# EAGLE schematic ESP32 Display 2.4 inch V1.0 (EAGLE 9.6.2)
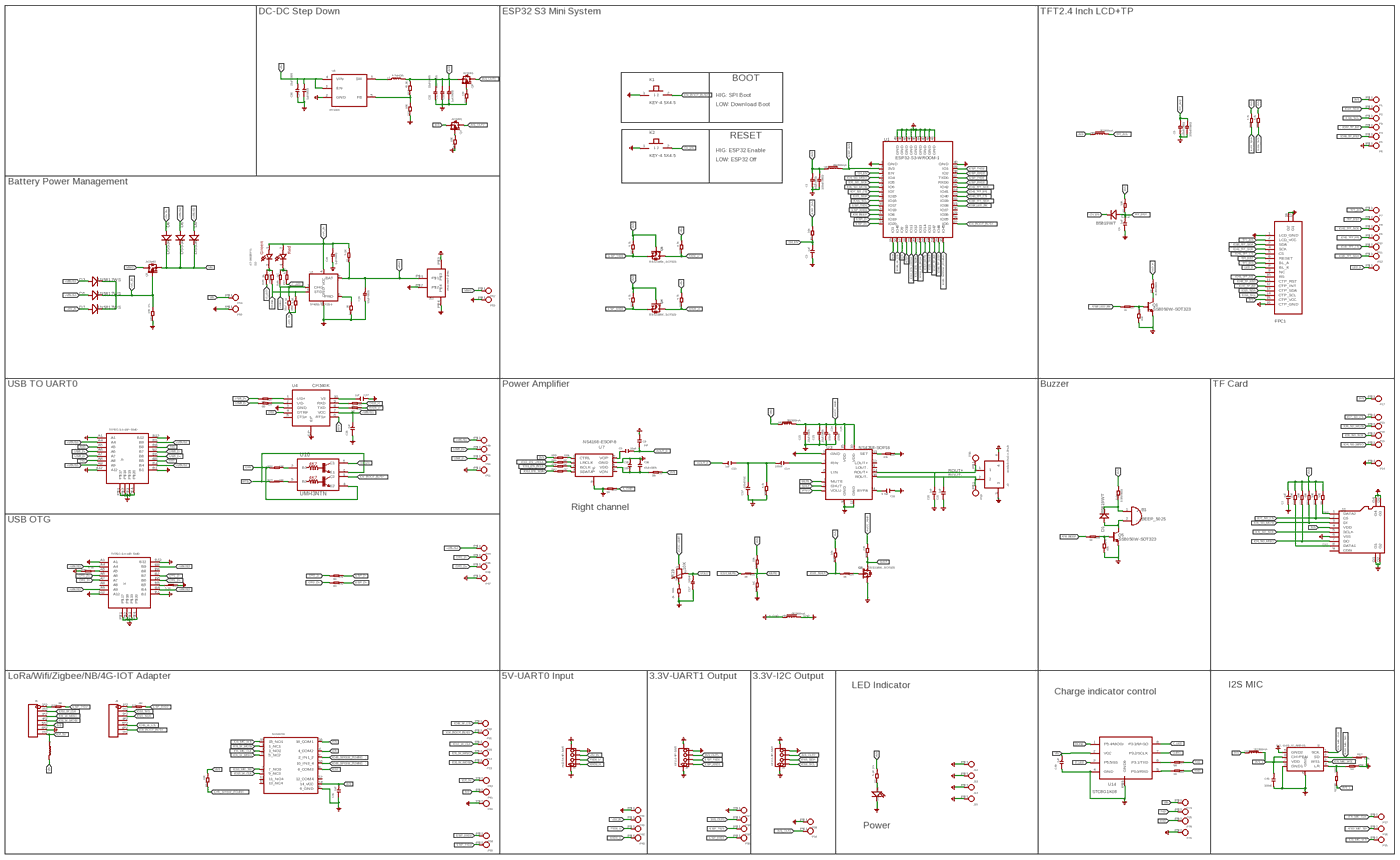
[diagram p0: schematic, sheet 1, overview]
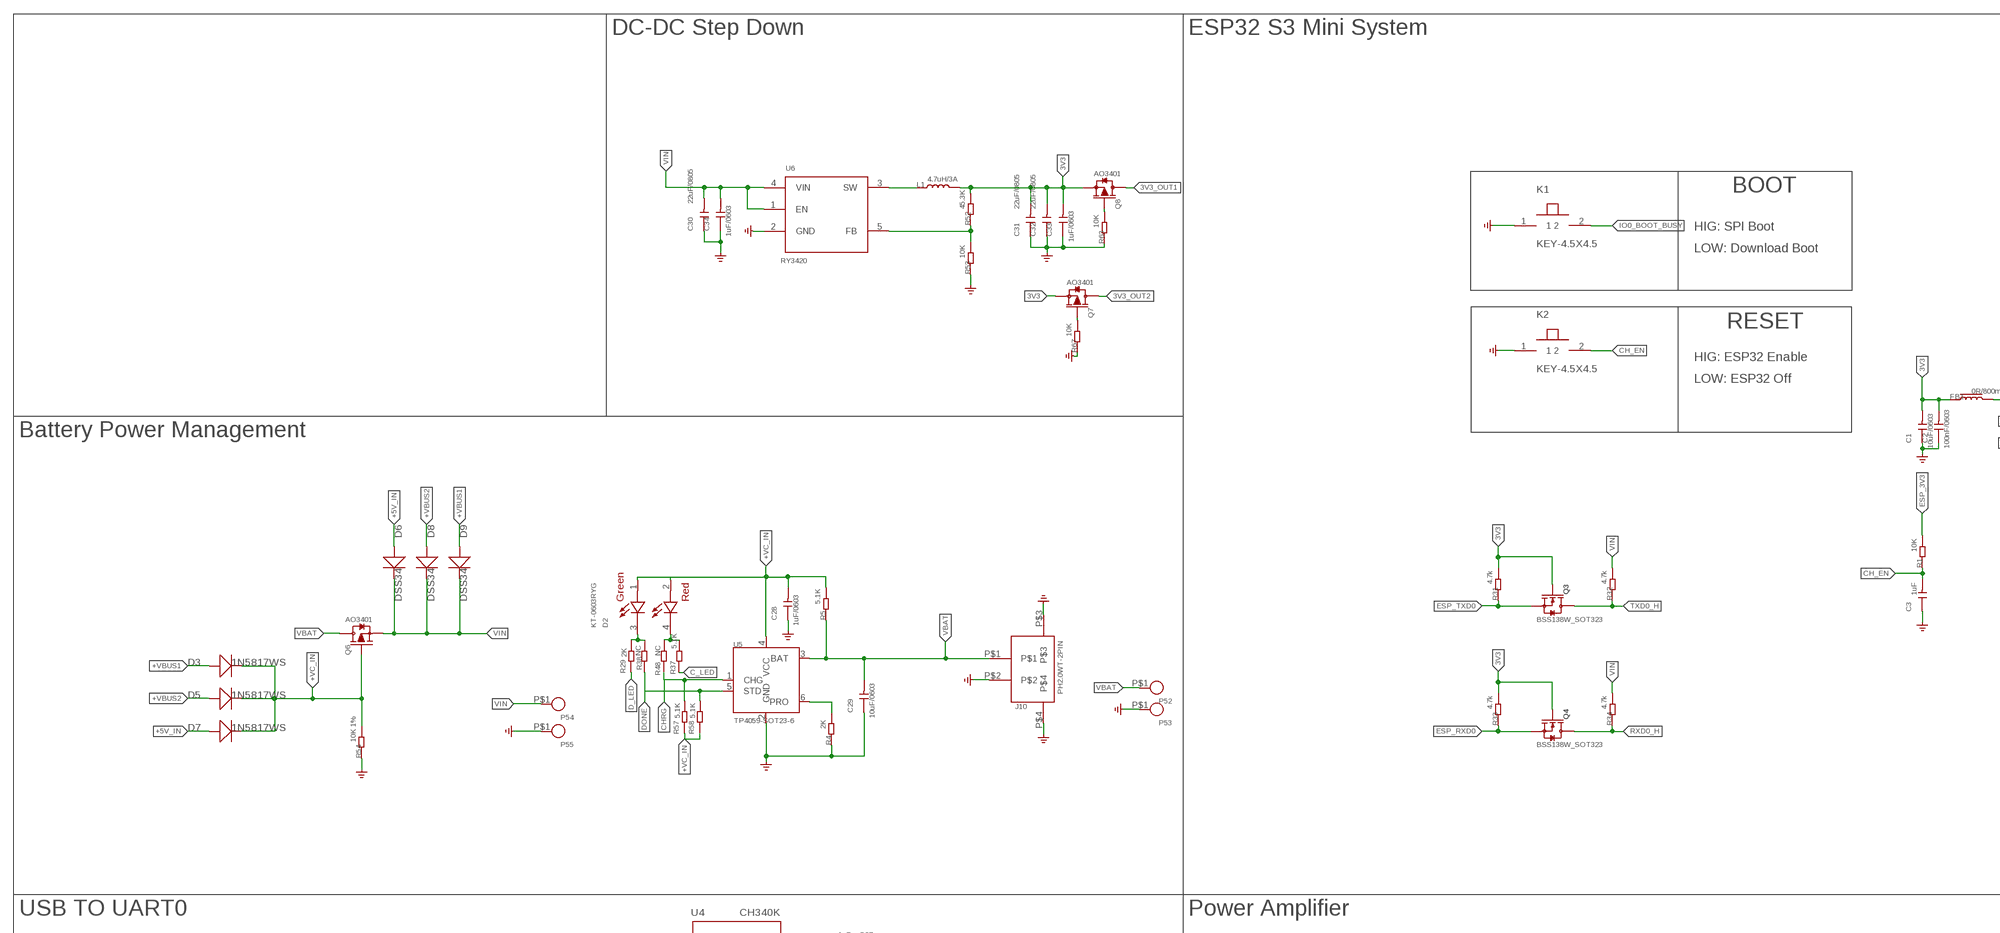
[diagram p1: schematic, sheet 1, part 1 of 4]
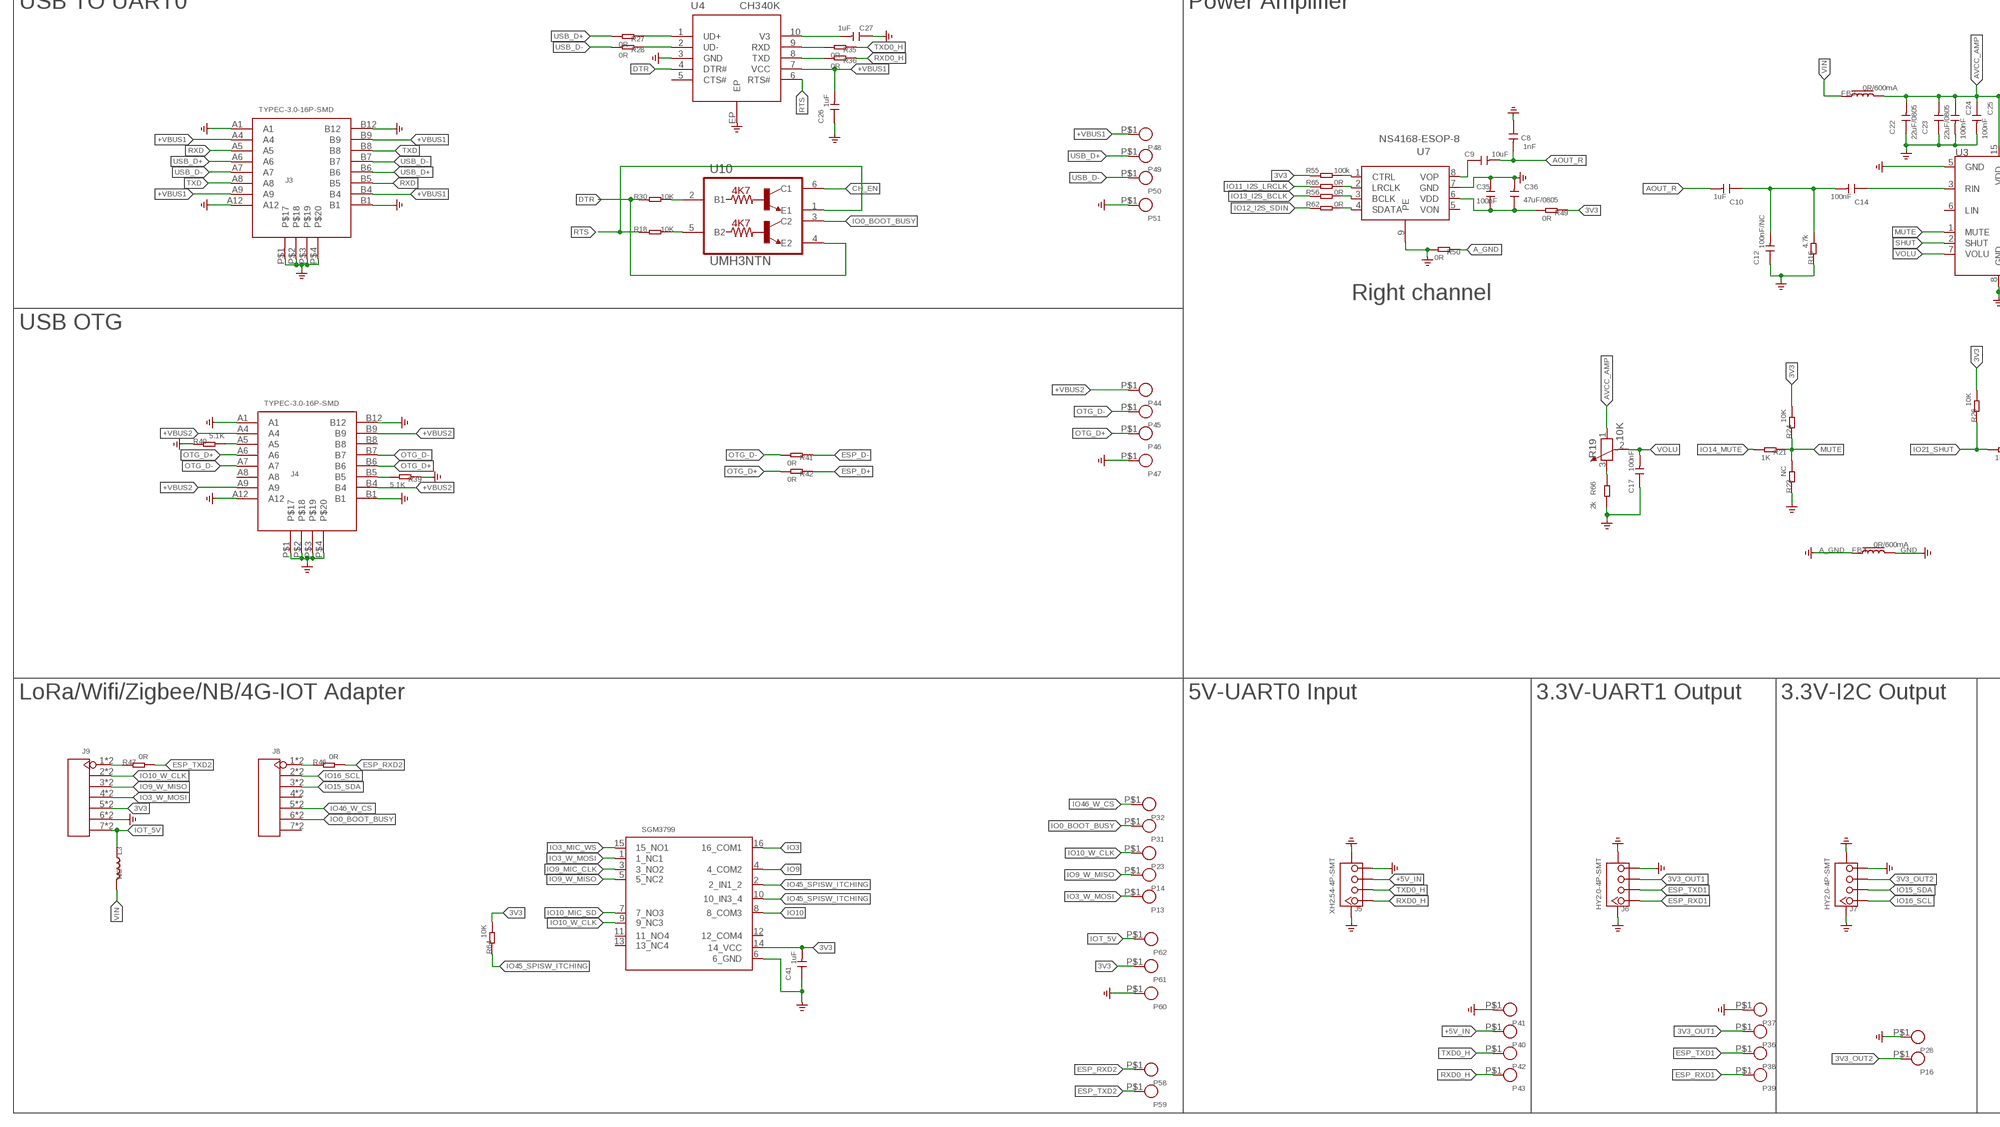
[diagram p2: schematic, sheet 1, part 2 of 4]
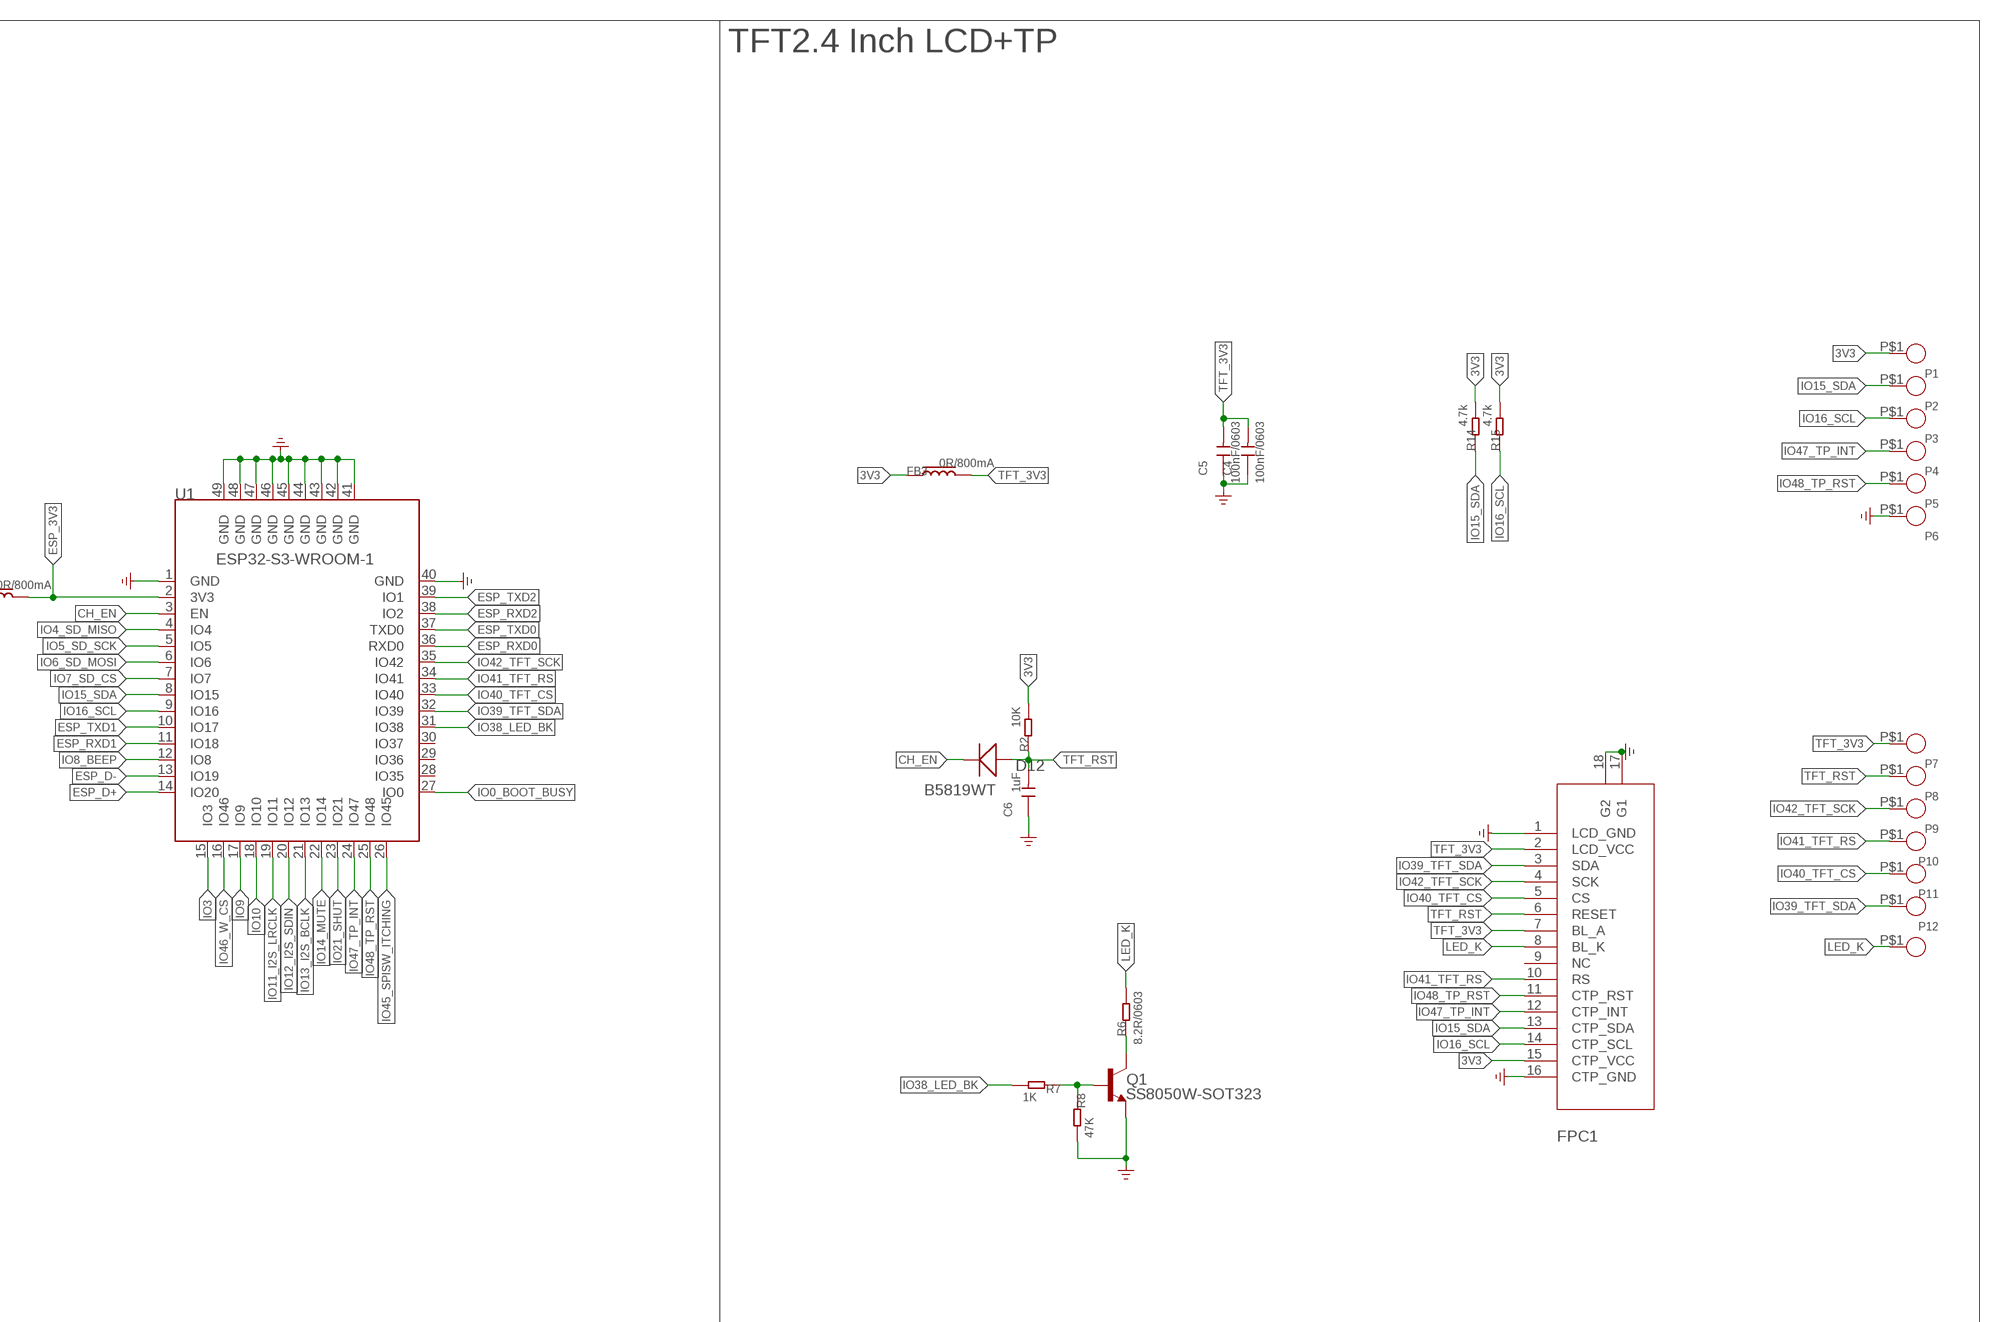
[diagram p3: schematic, sheet 1, part 3 of 4]
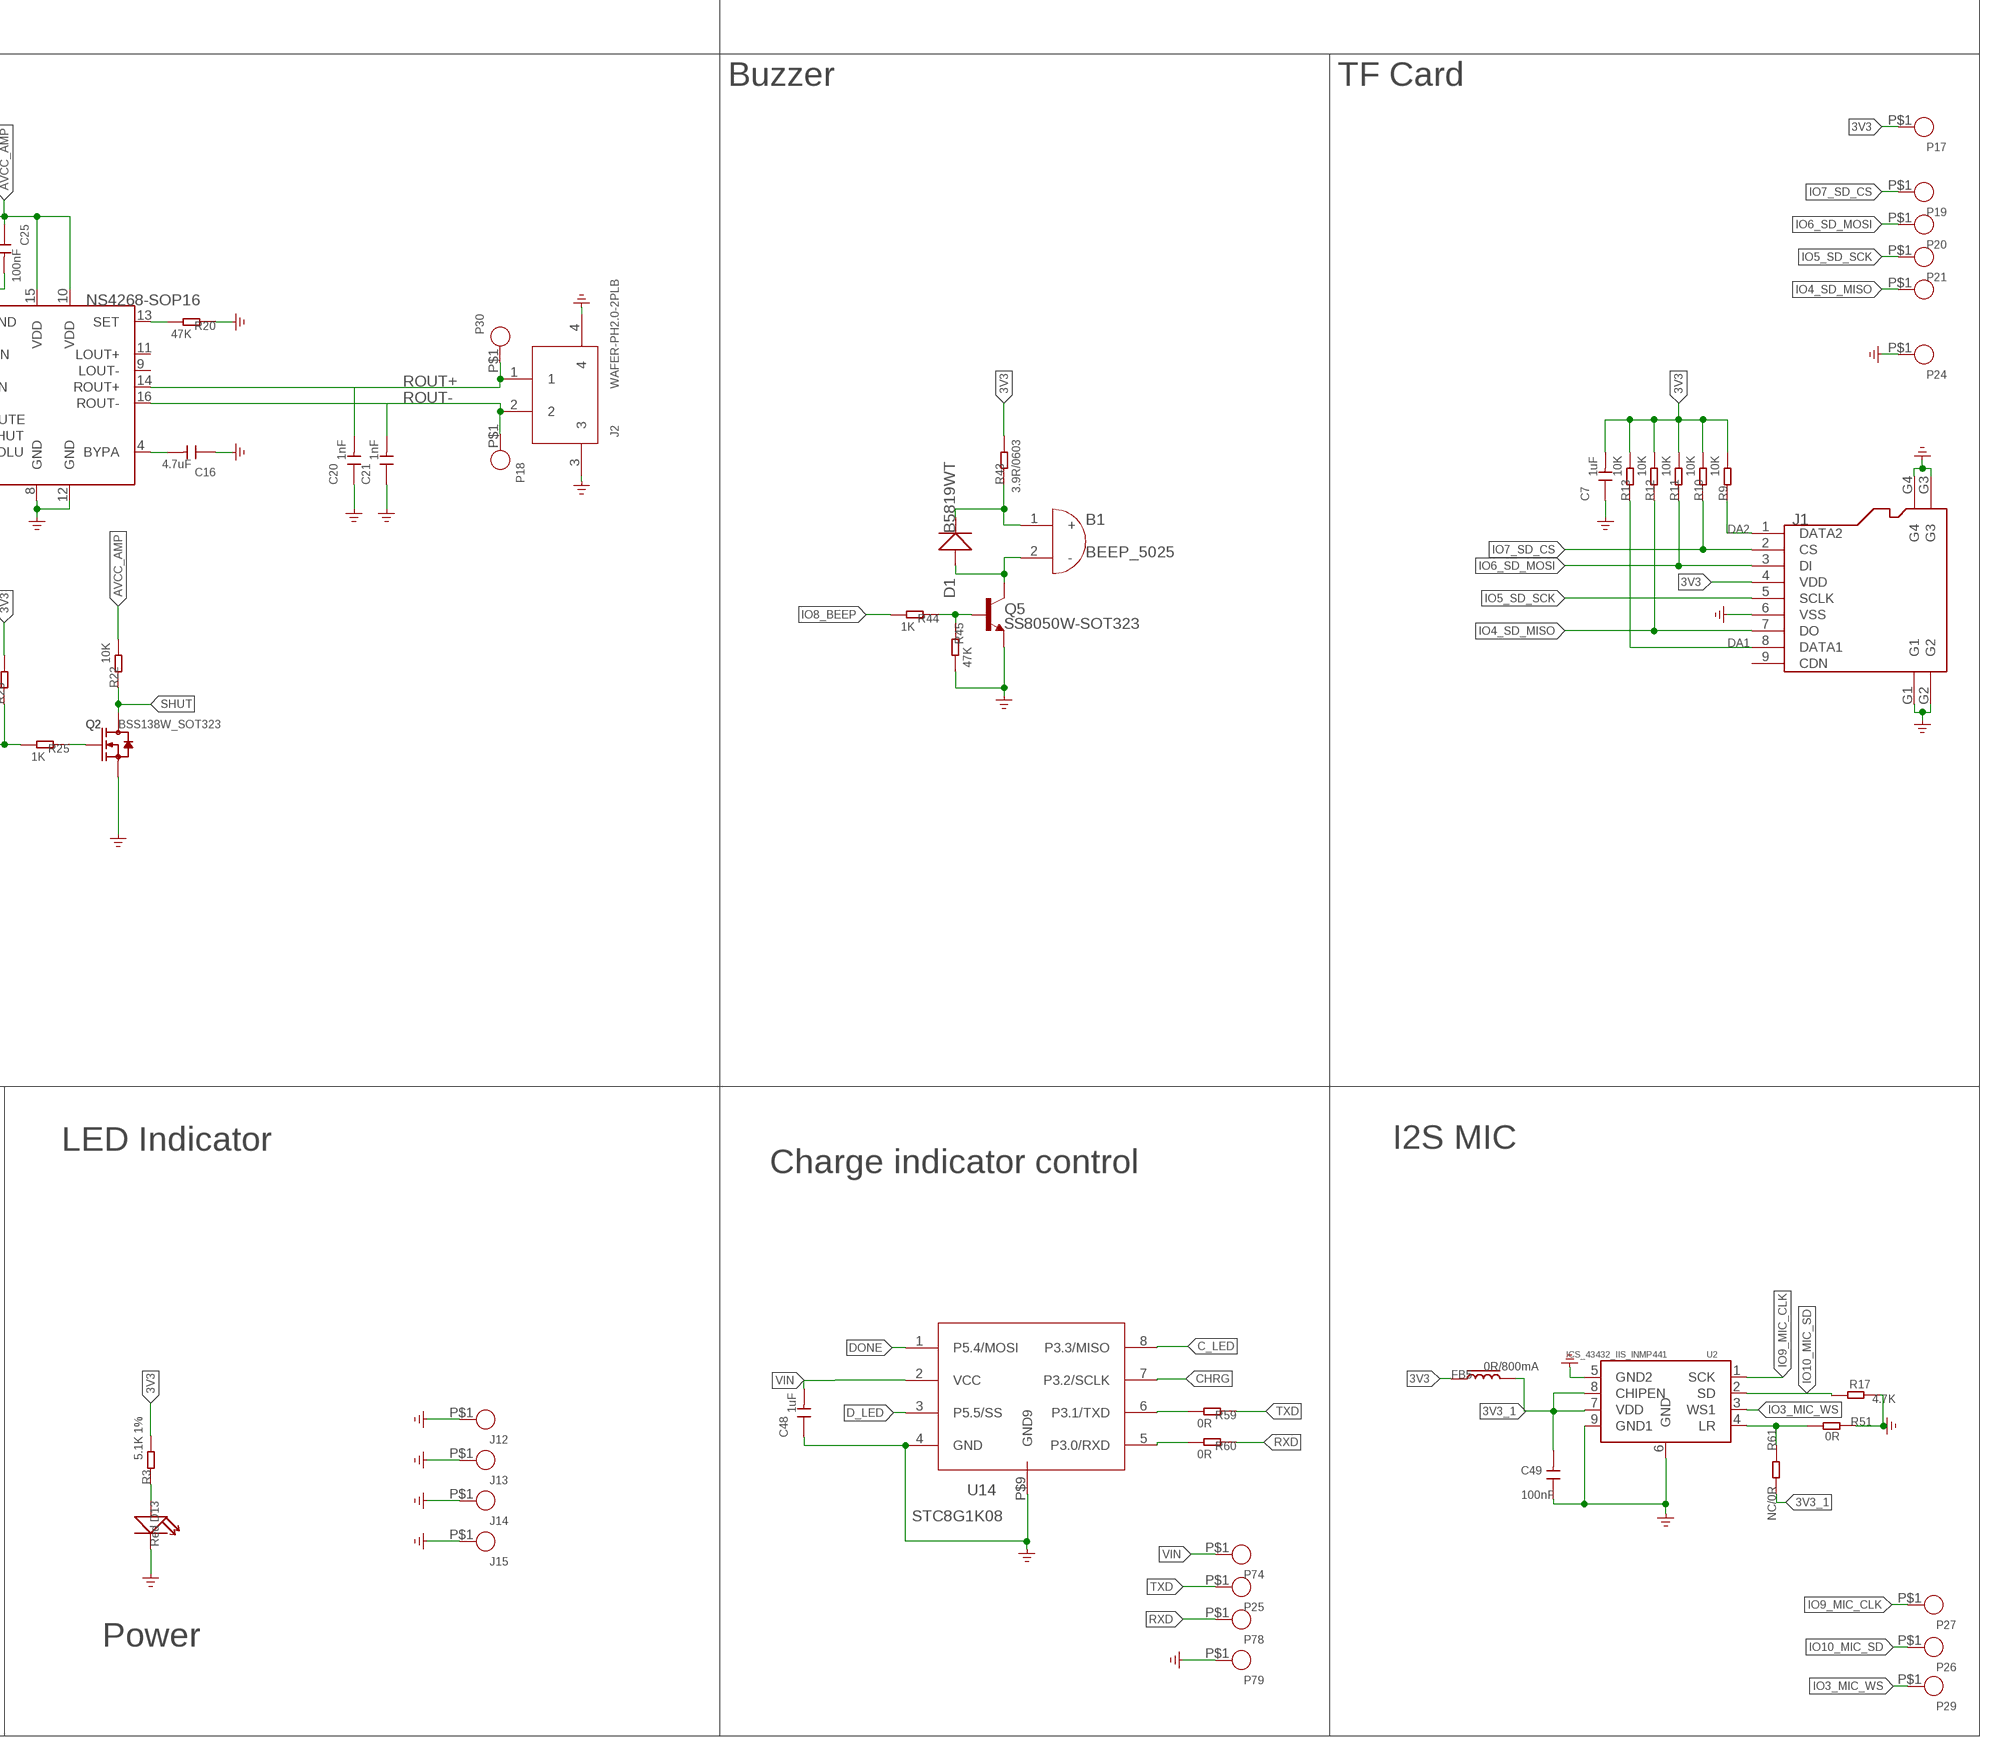
[diagram p4: schematic, sheet 1, part 4 of 4]

## Parts
B1  BEEP_5025  [BEEP_5025]
C1  10uF/0603  CAP  [C0603]
C2  100nF/0603  CAP  [C0603]
C3  1uF  CAPC0402-1  [C0402]
C4  100nF/0603  CAP  [C0603]
C5  100nF/0603  CAP  [C0603]
C6  1uF  CAPC0402-1  [C0402]
C7  1uF  CAPC0402-1  [C0402]
C8  1nF  CAPC0402-1  [C0402]
C9  10uF  CAPC0402-1  [C0402]
C10  1uF  CAPC0402-1  [C0402]
C12  100nF/NC  CAPC0402-1  [C0402]
C14  100nF  CAPC0402-1  [C0402]
C16  4.7uF  CAPC0402-1  [C0402]
C17  100nF  CAPC0402-1  [C0402]
C20  1nF  CAPC0402-1  [C0402]
C21  1nF  CAPC0402-1  [C0402]
C22  22uF/0805  CAPC0805  [C0805]
C23  22uF/0805  CAPC0805  [C0805]
C24  100nF  CAPC0402-1  [C0402]
C25  100nF  CAPC0402-1  [C0402]
C26  1uF  CAPC0402-1  [C0402]
C27  1uF  CAPC0402-1  [C0402]
C28  1uF/0603  CAP  [C0603]
C29  10uF/0603  CAP  [C0603]
C30  22uF/0805  CAPC0805  [C0805]
C31  22uF/0805  CAPC0805  [C0805]
C32  22uF/0805  CAPC0805  [C0805]
C33  1uF/0603  CAP  [C0603]
C34  1uF/0603  CAP  [C0603]
C35  100nF  CAPC0402-1  [C0402]
C36  47uF/0805  CAPC0805  [C0805]
C41  1uF  CAPC0402-1  [C0402]
C48  1uF  CAPC0402-1  [C0402]
C49  100nF  CAP  [C0603]
D1  B5819WT  DIODE0603  [D_SOD523]
D2  KT-0603RYG  [LED_KT-0603RYG]
D3  1N5817WS  DIODE0805  [D_SOD323]
D5  1N5817WS  DIODE0805  [D_SOD323]
D6  DSS34  DIODE  [D_SOD123FL]
D7  1N5817WS  DIODE0805  [D_SOD323]
D8  DSS34  DIODE  [D_SOD123FL]
D9  DSS34  DIODE  [D_SOD123FL]
D12  B5819WT  DIODE0603  [D_SOD523]
D13  Red  LED-SMT0603  [LED0603]
FB1  0R/800mA  FBL0603  [L0603]
FB2  0R/600mA  FBL0603  [L0603]
FB3  0R/800mA  FBL0603  [L0603]
FB4  0R/600mA  FBL0603  [L0603]
FB5  0R/800mA  FBL0603  [L0603]
FPC1  TFT-2.4-SPI-16P  [FPC-0.5MM-16P-SMD]
J1  HOLDER-MICROSD-9P  [9P-SMD-W/-RING]
J2  WAFER-PH2.0-2PLB  [CONN-TH_2P-P2.00_XUNPU_WAFER-PH2.0-2PLB]
J3  TYPEC-3.0-16P-SMD  [USB-3.0TYPEC-SMD]
J4  TYPEC-3.0-16P-SMD  [USB-3.0TYPEC-SMD]
J5  XH2.54-4P-SMT  [XH2.54-4P-SMD]
J6  HY2.0-4P-SMT  CONNECTOR_TWIG-4P-2.0-SMD-FEMALE-REINFORCEDD  [CONNECTOR_4P-SMD-2.0]
J7  HY2.0-4P-SMT  CONNECTOR_TWIG-4P-2.0-SMD-FEMALE-REINFORCEDD  [CONNECTOR_4P-SMD-2.0]
J8  HEADER-7P-18.28X2.5  [H7-2.54-18.28X2.5X5MM]
J9  HEADER-7P-18.28X2.5  [H7-2.54-18.28X2.5X5MM]
J10  PH2.0WT-2PIN  [PH2.0WT-2PIN]
J12  THO-M3.25MM-HOLE  [THO-M3.2*5MM-HOLE]
J13  THO-M3.25MM-HOLE  [THO-M3.2*5MM-HOLE]
J14  THO-M3.25MM-HOLE  [THO-M3.2*5MM-HOLE]
J15  THO-M3.25MM-HOLE  [THO-M3.2*5MM-HOLE]
K1  KEY-4.5X4.5  KEY-6KEY-4.5X4.5  [KEY-4.5X4.5-SMD]
K2  KEY-4.5X4.5  KEY-6KEY-4.5X4.5  [KEY-4.5X4.5-SMD]
L1  4.7uH/3A  LL0420  [L0420]
L3  NC  L0603  [L0603]
P1  TEST_PADPAD-1.5MM  [TEST_PAD-1.5MM]
P2  TEST_PADPAD-1.5MM  [TEST_PAD-1.5MM]
P3  TEST_PADPAD-1.5MM  [TEST_PAD-1.5MM]
P4  TEST_PADPAD-1.5MM  [TEST_PAD-1.5MM]
P5  TEST_PADPAD-1.5MM  [TEST_PAD-1.5MM]
P6  TEST_PADPAD-1.5MM  [TEST_PAD-1.5MM]
P7  TEST_PADPAD-1.5MM  [TEST_PAD-1.5MM]
P8  TEST_PADPAD-1.5MM  [TEST_PAD-1.5MM]
P9  TEST_PADPAD-1.5MM  [TEST_PAD-1.5MM]
P10  TEST_PADPAD-1.5MM  [TEST_PAD-1.5MM]
P11  TEST_PADPAD-1.5MM  [TEST_PAD-1.5MM]
P12  TEST_PADPAD-1.5MM  [TEST_PAD-1.5MM]
P13  TEST_PADPAD-1.5MM  [TEST_PAD-1.5MM]
P14  TEST_PADPAD-1.5MM  [TEST_PAD-1.5MM]
P15  TEST_PADPAD-1.5MM  [TEST_PAD-1.5MM]
P16  TEST_PADPAD-1.5MM  [TEST_PAD-1.5MM]
P17  TEST_PADPAD-1.5MM  [TEST_PAD-1.5MM]
P18  TEST_PADPAD-1.5MM  [TEST_PAD-1.5MM]
P19  TEST_PADPAD-1.5MM  [TEST_PAD-1.5MM]
P20  TEST_PADPAD-1.5MM  [TEST_PAD-1.5MM]
P21  TEST_PADPAD-1.5MM  [TEST_PAD-1.5MM]
P22  TEST_PADPAD-1.5MM  [TEST_PAD-1.5MM]
P23  TEST_PADPAD-1.5MM  [TEST_PAD-1.5MM]
P24  TEST_PADPAD-1.5MM  [TEST_PAD-1.5MM]
P25  TEST_PADPAD-1.5MM  [TEST_PAD-1.5MM]
P26  TEST_PADPAD-1.5MM  [TEST_PAD-1.5MM]
P27  TEST_PADPAD-1.5MM  [TEST_PAD-1.5MM]
P28  TEST_PADPAD-1.5MM  [TEST_PAD-1.5MM]
P29  TEST_PADPAD-1.5MM  [TEST_PAD-1.5MM]
P30  TEST_PADPAD-1.5MM  [TEST_PAD-1.5MM]
P31  TEST_PADPAD-1.5MM  [TEST_PAD-1.5MM]
P32  TEST_PADPAD-1.5MM  [TEST_PAD-1.5MM]
P36  TEST_PADPAD-1.5MM  [TEST_PAD-1.5MM]
P37  TEST_PADPAD-1.5MM  [TEST_PAD-1.5MM]
P38  TEST_PADPAD-1.5MM  [TEST_PAD-1.5MM]
P39  TEST_PADPAD-1.5MM  [TEST_PAD-1.5MM]
P40  TEST_PADPAD-1.5MM  [TEST_PAD-1.5MM]
P41  TEST_PADPAD-1.5MM  [TEST_PAD-1.5MM]
P42  TEST_PADPAD-1.5MM  [TEST_PAD-1.5MM]
P43  TEST_PADPAD-1.5MM  [TEST_PAD-1.5MM]
P44  TEST_PADPAD-1.5MM  [TEST_PAD-1.5MM]
P45  TEST_PADPAD-1.5MM  [TEST_PAD-1.5MM]
P46  TEST_PADPAD-1.5MM  [TEST_PAD-1.5MM]
P47  TEST_PADPAD-1.5MM  [TEST_PAD-1.5MM]
P48  TEST_PADPAD-1.5MM  [TEST_PAD-1.5MM]
P49  TEST_PADPAD-1.5MM  [TEST_PAD-1.5MM]
P50  TEST_PADPAD-1.5MM  [TEST_PAD-1.5MM]
P51  TEST_PADPAD-1.5MM  [TEST_PAD-1.5MM]
P52  TEST_PADPAD-1.5MM  [TEST_PAD-1.5MM]
P53  TEST_PADPAD-1.5MM  [TEST_PAD-1.5MM]
P54  TEST_PADPAD-1.5MM  [TEST_PAD-1.5MM]
P55  TEST_PADPAD-1.5MM  [TEST_PAD-1.5MM]
P58  TEST_PADPAD-1.5MM  [TEST_PAD-1.5MM]
P59  TEST_PADPAD-1.5MM  [TEST_PAD-1.5MM]
P60  TEST_PADPAD-1.5MM  [TEST_PAD-1.5MM]
P61  TEST_PADPAD-1.5MM  [TEST_PAD-1.5MM]
P62  TEST_PADPAD-1.5MM  [TEST_PAD-1.5MM]
P74  TEST_PADPAD-1.5MM  [TEST_PAD-1.5MM]
P78  TEST_PADPAD-1.5MM  [TEST_PAD-1.5MM]
P79  TEST_PADPAD-1.5MM  [TEST_PAD-1.5MM]
Q1  SS8050W-SOT323  TRANS_NPN  [MOS_SOT323]
Q2  BSS138W_SOT323  MOSFET-NSI1304BDL  [MOS_SOT323]
Q3  BSS138W_SOT323  MOSFET-NSI1304BDL  [MOS_SOT323]
Q4  BSS138W_SOT323  MOSFET-NSI1304BDL  [MOS_SOT323]
Q5  SS8050W-SOT323  TRANS_NPN  [MOS_SOT323]
Q6  AO3401  MOSFET-PSOT23  [PMOS_SOT23]
Q7  AO3401  MOSFET-PSOT23  [PMOS_SOT23]
Q8  AO3401  MOSFET-PSOT23  [PMOS_SOT23]
R1  10K  RES-0402  [R0402]
R2  10K  RES-0402  [R0402]
R3  5.1K 1%  RES-0402  [R0402]
R4  2K  RES-0402  [R0402]
R5  5.1K  RES-0402  [R0402]
R6  8.2R/0603  RES-0603  [R0603-SP]
R7  1K  RES-0402  [R0402]
R8  47K  RES-0402  [R0402]
R9  10K  RES-0402  [R0402]
R10  10K  RES-0402  [R0402]
R11  10K  RES-0402  [R0402]
R12  10K  RES-0402  [R0402]
R13  10K  RES-0402  [R0402]
R14  4.7k  RES-0402  [R0402]
R15  4.7k  RES-0402  [R0402]
R16  4.7k  RES-0402  [R0402]
R17  4.7K  RES-0603  [R0603-SP]
R18  10K  RES-0402  [R0402]
R19  10K  R-POTENTIOMETER-SMD  [3P-SMD-SQUA-3.6X3.3]
R20  47K  RES-0402  [R0402]
R21  1K  RES-0402  [R0402]
R22  10K  RES-0402  [R0402]
R23  NC  RES-0402  [R0402]
R24  10K  RES-0402  [R0402]
R25  1K  RES-0402  [R0402]
R26  10K  RES-0402  [R0402]
R27  0R  RES-0402  [R0402]
R28  0R  RES-0402  [R0402]
R29  2K  RES-0402  [R0402]
R30  10K  RES-0402  [R0402]
R31  4.7k  RES-0402  [R0402]
R32  4.7k  RES-0402  [R0402]
R33  4.7k  RES-0402  [R0402]
R34  4.7k  RES-0402  [R0402]
R35  0R  RES-0402  [R0402]
R36  0R  RES-0402  [R0402]
R37  5.1K  RES-0402  [R0402]
R38  NC  RES-0402  [R0402]
R39  5.1K  RES-0402  [R0402]
R40  5.1K  RES-0402  [R0402]
R41  0R  RES-0402  [R0402]
R42  0R  RES-0402  [R0402]
R43  3.9R/0603  RES-0603  [R0603-SP]
R44  1K  RES-0402  [R0402]
R45  47K  RES-0402  [R0402]
R46  0R  RES-0402  [R0402]
R47  0R  RES-0402  [R0402]
R48  NC  RES-0402  [R0402]
R49  0R  RES-0402  [R0402]
R50  0R  RES-0402  [R0402]
R51  0R  RES-0603  [R0603-SP]
R52  45.3K  RES-0402  [R0402]
R53  10K  RES-0402  [R0402]
R54  10K 1%  RES-0402  [R0402]
R55  100k  RES-0402  [R0402]
R56  0R  RES-0402  [R0402]
R57  5.1K  RES-0402  [R0402]
R58  5.1K  RES-0402  [R0402]
R59  0R  RES-0402  [R0402]
R60  0R  RES-0402  [R0402]
R61  NC/0R  RES-0603  [R0603-SP]
R62  0R  RES-0402  [R0402]
R63  10K  RES-0402  [R0402]
R64  10K  RES-0402  [R0402]
R65  0R  RES-0402  [R0402]
R66  2k  RES-0402  [R0402]
R67  10K  RES-0402  [R0402]
U1  ESP32-S3-WROOM-1  [ESP32-S3-WROOM-1-SMD41]
U2  ICS_43432_IIS_INMP441  [ICS_43432_IIS_INMP441]
U3  NS4268-SOP16  [SOP-16]
U4  CH340K  [ESOP-10-EP-150MIL]
U5  TP4059-SOT23-6  [SOT23-6L]
U6  RY3420  HM3416H  [IC_SOT23-5]
U7  NS4168-ESOP-8  [NS4168-ESOP-8]
U8  SGM3799  IC_SGM3799_TQFN2.6X1.8_16L  [IC_SGM3799_TQFN2.6X1.8_16L]
U10  UMH3NTN  [SOP65P210X100-6N]
U14  STC8G1K08  [DFN8]

## Nets
3V3: C1.2 C2.2 C7.2 C31.2 C32.2 C33.2 C41.2 FB1.1 FB3.1 FB5.1 FPC1.15(CTP_VCC) J1.4(VDD) J9.5 J9.5-5 L1.2 P1.P$1 P17.P$1 P61.P$1 Q3.1(G) Q4.1(G) Q7.2(S) Q8.2(S) R2.2 R3.2 R9.2 R10.2 R11.2 R12.2 R13.2 R14.2 R15.2 R24.2 R26.2 R31.2 R33.2 R43.2 R49.1 R52.2 R55.2 R64.2 U8.14(14_VCC)
3V3_1: C49.2 FB5.2 R61.2 U2.7(VDD) U2.8(CHIPEN)
3V3_OUT1: J6.3 P36.P$1 Q8.3(D)
3V3_OUT2: J7.3 P16.P$1 Q7.3(D)
+5V_IN: D6.+ D7.+ J5.3 P40.P$1
+VBUS1: C26.2 D3.+ D9.+ J3.A4 J3.A9 J3.B4 J3.B9 P48.P$1 U4.7(VCC)
+VBUS2: D5.+ D8.+ J4.A4 J4.A9 J4.B4 J4.B9 P44.P$1
+VC_IN: C28.2 D2.1 D2.2 D3.- D5.- D7.- Q6.1(G) R5.2 R54.2 R57.1 R58.1 U5.4(VCC)
A_GND: C12.1 C16.1 C17.1 C20.1 C21.1 C22.1 C23.1 C24.2 C25.2 FB4.1 J2.3 J2.4 Q2.2(S) R16.1 R20.1 R23.1 R50.1 R66.2 U3.5(GND) U3.8(GND) U3.12(GND)
AOUT_R: C8.2 C9.2 C10.2
AVCC_AMP: C22.2 C23.2 C24.1 C25.1 FB2.2 R19.1 R22.2 U3.10(VDD) U3.15(VDD)
C_LED: R37.1 U14.8(P3.3/MISO)
CH_EN: C3.2 D12.- K2.2 R1.1 U1.3(EN) U10.6(C1)
CHRG: R48.1 R57.2 U5.1(CHG) U14.7(P3.2/SCLK)
D_LED: R29.1 U14.3(P5.5/SS)
DA1: J1.8(DATA1) R13.1
DA2: J1.1(DATA2) R9.1
DONE: R38.1 R58.2 U5.5(STD) U14.1(P5.4/MOSI)
DTR: R30.2 U4.4(DTR#) U10.4(E2)
ESP_3V3: FB1.2 R1.2 U1.2(3V3)
ESP_D+: R42.1 U1.14(IO20)
ESP_D-: R41.1 U1.13(IO19)
ESP_RXD0: Q4.2(S) R33.1 U1.36(RXD0)
ESP_RXD1: J6.1 P39.P$1 U1.11(IO18)
ESP_RXD2: P58.P$1 R46.2 U1.38(IO2)
ESP_TXD0: Q3.2(S) R31.1 U1.37(TXD0)
ESP_TXD1: J6.2 P38.P$1 U1.10(IO17)
ESP_TXD2: P59.P$1 R47.2 U1.39(IO1)
GND: C1.1 C2.1 C3.1 C4.1 C5.1 C6.1 C7.1 C8.1 C26.1 C27.1 C28.1 C29.1 C30.1 C31.1 C32.1 C33.1 C34.1 C35.2 C36.2 C41.1 C48.1 C49.1 D13.- FB4.2 FPC1.1(LCD_GND) FPC1.16(CTP_GND) FPC1.17(G1) FPC1.18(G2) J1.6(VSS) J1.G1 J1.G2 J1.G3 J1.G4 J3.A1 J3.A12 J3.B1 J3.B12 J3.P$1 J3.P$2 J3.P$3 J3.P$4 J4.A1 J4.A12 J4.B1 J4.B12 J4.P$1 J4.P$2 J4.P$3 J4.P$4 J5.4 J5.5(SS1) J5.6(SS2) J6.4 J6.SS1 J6.SS2 J7.4 J7.SS1 J7.SS2 J9.6 J9.6-6 J10.P$2 J10.P$3 J10.P$4 J12.P$1 J13.P$1 J14.P$1 J15.P$1 K1.1 K2.1 P6.P$1 P24.P$1 P28.P$1 P37.P$1 P41.P$1 P47.P$1 P51.P$1 P53.P$1 P55.P$1 P60.P$1 P79.P$1 Q1.2(E) Q5.2(E) R4.1 R8.2 R17.2 R39.1 R40.1 R45.2 R50.2 R51.1 R53.1 R54.1 R63.1 R67.1 U1.1(GND) U1.40(GND) U1.41(GND) U1.42(GND) U1.43(GND) U1.44(GND) U1.45(GND) U1.46(GND) U1.47(GND) U1.48(GND) U1.49(GND) U2.5(GND2) U2.6(GND) U2.9(GND1) U4.3(GND) U4.EP U5.2(GND) U6.2(GND) U7.7(GND) U7.9(PE) U8.6(6_GND) U14.4(GND) U14.P$9(GND9)
IO0_BOOT_BUSY: J8.6 J8.6-6 K1.2 P31.P$1 U1.27(IO0) U10.3(C2)
IO3: U1.15(IO3) U8.16(16_COM1)
IO3_MIC_WS: P29.P$1 U2.3(WS1) U8.15(15_NO1)
IO3_W_MOSI: J9.4 J9.4-4 P13.P$1 U8.1(1_NC1)
IO4_SD_MISO: J1.7(DO) P22.P$1 R12.1 U1.4(IO4)
IO5_SD_SCK: J1.5(SCLK) P21.P$1 U1.5(IO5)
IO6_SD_MOSI: J1.3(DI) P20.P$1 R11.1 U1.6(IO6)
IO7_SD_CS: J1.2(CS) P19.P$1 R10.1 U1.7(IO7)
IO8_BEEP: R44.2 U1.12(IO8)
IO9: U1.17(IO9) U8.4(4_COM2)
IO9_MIC_CLK: P27.P$1 U2.1(SCK) U8.3(3_NO2)
IO9_W_MISO: J9.3 J9.3-3 P14.P$1 U8.5(5_NC2)
IO10: U1.18(IO10) U8.8(8_COM3)
IO10_MIC_SD: P26.P$1 R17.1 U2.2(SD) U8.7(7_NO3)
IO10_W_CLK: J9.2 J9.2-2 P23.P$1 U8.9(9_NC3)
IO11_I2S_LRCLK: R65.2 U1.19(IO11)
IO12_I2S_SDIN: R62.2 U1.20(IO12)
IO13_I2S_BCLK: R56.2 U1.21(IO13)
IO14_MUTE: R21.2 U1.22(IO14)
IO15_SDA: FPC1.13(CTP_SDA) J7.2 J8.3 J8.3-3 P2.P$1 R14.1 U1.8(IO15)
IO16_SCL: FPC1.14(CTP_SCL) J7.1 J8.2 J8.2-2 P3.P$1 R15.1 U1.9(IO16)
IO21_SHUT: R25.2 R26.1 U1.23(IO21)
IO38_LED_BK: R7.2 U1.31(IO38)
IO39_TFT_SDA: FPC1.3(SDA) P12.P$1 U1.32(IO39)
IO40_TFT_CS: FPC1.5(CS) P11.P$1 U1.33(IO40)
IO41_TFT_RS: FPC1.10(RS) P10.P$1 U1.34(IO41)
IO42_TFT_SCK: FPC1.4(SCK) P9.P$1 U1.35(IO42)
IO45_SPISW_ITCHING: R64.1 U1.26(IO45) U8.2(2_IN1_2) U8.10(10_IN3_4)
IO46_W_CS: J8.5 J8.5-5 P32.P$1 U1.16(IO46)
IO47_TP_INT: FPC1.12(CTP_INT) P4.P$1 U1.24(IO47)
IO48_TP_RST: FPC1.11(CTP_RST) P5.P$1 U1.25(IO48)
IOT_5V: J9.7 J9.7-7 L3.1 P62.P$1
LED_K: FPC1.8(BL_K) P15.P$1 R6.2
MUTE: R21.1 R23.2 R24.1 U3.1(MUTE)
N$1: Q1.3(C) R6.1
N$2: D13.+ R3.1
N$3: Q1.1(B) R7.1 R8.1
N$4: R59.2 U14.6(P3.1/TXD)
N$5: R60.2 U14.5(P3.0/RXD)
N$6: R51.2 R61.1 U2.4(LR)
N$7: C14.1 U3.3(RIN)
N$8: R19.3 R66.1
N$9: C10.1 C12.2 C14.2 R16.2
N$10: R4.2 U5.6(PRO)
N$11: R20.2 U3.13(SET)
N$12: C16.2 U3.4(BYPA)
N$13: Q2.1(G) R25.1
N$14: R27.1 U4.1(UD+)
N$15: R28.1 U4.2(UD-)
N$16: L1.1 U6.3(SW)
N$17: R30.1 U10.2(B1)
N$18: R18.1 U10.5(B2)
N$19: Q8.1(G) R63.2
N$20: C27.2 U4.10(V3)
N$21: Q7.1(G) R67.2
N$22: R35.2 U4.9(RXD)
N$23: R36.2 U4.8(TXD)
N$24: J9.1 J9.1-1 R47.1
N$25: J4.B5 R39.2
N$26: J4.A5 R40.2
N$27: Q5.1(B) R44.1 R45.1
N$28: B1.2(-) D1.+ Q5.3(C)
N$29: B1.1(+) D1.- R43.1
N$31: R52.1 R53.2 U6.5(FB)
N$36: J8.1 J8.1-1 R46.1
N$38: R55.1 U7.1(CTRL)
N$39: R65.1 U7.2(LRCLK)
N$40: D2.3 R29.2 R38.2
N$43: D2.4 R37.2 R48.2
N$46: R56.1 U7.3(BCLK)
N$47: R62.1 U7.4(SDATA)
N$49: C35.1 C36.1 R49.2 U7.6(VDD)
N$50: C9.1 U7.8(VOP)
OTG_D+: J4.A6 J4.B6 P46.P$1 R42.2
OTG_D-: J4.A7 J4.B7 P45.P$1 R41.2
ROUT+: C20.2 J2.1 P30.P$1 U3.14(ROUT+)
ROUT-: C21.2 J2.2 P18.P$1 U3.16(ROUT-)
RTS: R18.2 U4.6(RTS#) U10.1(E1)
RXD: J3.A5 J3.B5 P78.P$1 R60.1
RXD0_H: J5.1 P43.P$1 Q4.3(D) R34.1 R36.1
SHUT: Q2.3(D) R22.1 U3.2(SHUT)
TFT_3V3: C4.2 C5.2 FB3.2 FPC1.2(LCD_VCC) FPC1.7(BL_A) P7.P$1
TFT_RST: C6.2 D12.+ FPC1.6(RESET) P8.P$1 R2.1
TXD: J3.A8 J3.B8 P25.P$1 R59.1
TXD0_H: J5.2 P42.P$1 Q3.3(D) R32.1 R35.1
USB_D+: J3.A6 J3.B6 P49.P$1 R27.2
USB_D-: J3.A7 J3.B7 P50.P$1 R28.2
VBAT: C29.2 J10.P$1 P52.P$1 Q6.3(D) R5.1 U5.3(BAT)
VIN: C30.2 C34.2 C48.2 D6.- D8.- D9.- FB2.1 L3.2 P54.P$1 P74.P$1 Q6.2(S) R32.2 R34.2 U6.1(EN) U6.4(VIN) U14.2(VCC)
VOLU: C17.2 R19.2 U3.7(VOLU)
Unconnected: FPC1.9(NC) J1.9(CDN) J4.A8 J4.B8 J8.4 J8.4-4 J8.7 J8.7-7 U1.28(IO35) U1.29(IO36) U1.30(IO37) U3.6(LIN) U3.9(LOUT-) U3.11(LOUT+) U4.5(CTS#) U7.5(VON) U8.11(11_NO4) U8.12(12_COM4) U8.13(13_NC4)

## Notes on the sheet
- DC-DC Step Down | ESP32 S3 Mini System | TFT2.4 Inch LCD+TP
- BOOT
- HIG: SPI Boot
- LOW: Download Boot
- RESET
- HIG: ESP32 Enable
- LOW: ESP32 Off
- Battery Power Management
- USB TO UART0 | Power Amplifier | Buzzer | TF Card
- Right channel
- USB OTG
- LoRa/Wifi/Zigbee/NB/4G-IOT Adapter | 5V-UART0 Input | 3.3V-UART1 Output | 3.3V-I2C Output
- LED Indicator | I2S MIC
- Charge indicator control
- Power

## Library data of the parts
B1 = CrowPanel_Advance_HMI:BEEP_5025
C1-C10 C12 C14 C16 C17 C20-C36 C41 C48 C49 = CrowPanel_Advance_HMI:CAP*
D1 D3 D5-D9 D12 = CrowPanel_Advance_HMI:DIODE*
D2 = KT-0603RYG:KT-0603RYG: Check availability <https://pricing.snapeda.com/parts/KT-0603R/Hubei%20KENTO%20Elec/view-part?ref=eda>
D13 = CrowPanel_Advance_HMI:LED-SMT*
FB1-FB5 = CrowPanel_Advance_HMI:FB*
FPC1 = CrowPanel_Advance_HMI:TFT-2.4-SPI-16P
J1 = CrowPanel_Advance_HMI:HOLDER-MICROSD-9P
J2 = CrowPanel_Advance_HMI:WAFER-PH2.0-2PLB
J3 J4 = CrowPanel_Advance_HMI:TYPEC-3.0-16P-SMD
J5 = CrowPanel_Advance_HMI:XH2.54-4P-SMT
J6 J7 = CrowPanel_Advance_HMI:CONNECTOR_TWIG-4P-2.0-SMD-FEMALE-REINFORCE
J8 J9 = CrowPanel_Advance_HMI:HEADER-7P
J10 = CrowPanel_Advance_HMI:PH2.0WT-2PIN
J12-J15 = CrowPanel_Advance_HMI:THO-M3.2*5MM-HOLE
K1 K2 = CrowPanel_Advance_HMI:KEY-6
L1 L3 = CrowPanel_Advance_HMI:L*
P1-P32 P36-P55 P58-P62 P74 P78 P79 = CrowPanel_Advance_HMI:TEST_PAD*
Q1 Q5 = CrowPanel_Advance_HMI:TRANS_NPN: NPN transistor Current controlled devices typically used to amplify current or used as a switch. BC547 - COM-08928 <http://www.sparkfun.com/products/8928> (TO-92 45V 100mA) (1.Collector 2.Base 3.Emitter) 2N3904 - COM-00521 <http://www.sparkfun.com/products/521> (TO-92 40V 200mA) (1.Emitter 2.Base 3.Collector) P2N2222A - COM-12852 <http://www.sparkfun.com/products/12852> (TO-92 40V 600mA) (1.Collector 2.Base 3.Emitter)
Q2-Q4 = CrowPanel_Advance_HMI:MOSFET-N*: IRLL014: http://www.vishay.com/docs/91319/sihll014.pdf
Q6-Q8 = CrowPanel_Advance_HMI:MOSFET-P: IRLL014: http://www.vishay.com/docs/91319/sihll014.pdf
R1-R18 R20-R67 = CrowPanel_Advance_HMI:RES*
R19 = CrowPanel_Advance_HMI:R-POTENTIOMETER*: Potentiometer
U1 = CrowPanel_Advance_HMI:ESP32-S3-WROOM-1
U2 = untitled:ICS_43432_IIS_INMP441
U3 = CrowPanel_Advance_HMI:NS4268-SOP16
U4 = sale:CH340K
U5 = CrowPanel_Advance_HMI:TP4059-SOT23-6
U6 = CrowPanel_Advance_HMI:HM3416H
U7 = STC_MCUSTC8G1K08A:NS4168-ESOP-8
U8 = cooper:IC_SGM3799_TQFN2.6X1.8_16L
U10 = UMH3NTN:UMH3NTN: Dual NPN BJT with 4.7K Base resistor Datasheet <https://fscdn.rohm.com/en/products/databook/datasheet/discrete/transistor/digital/umh3ntn-e.pdf> BUY NOW <https://www.digikey.ca/en/products/detail/rohm-semiconductor/umh3ntn/659279> Check availability <https://pricing.snapeda.com/parts/UMH3NTN/Rohm/view-part?ref=eda>; AVAILABILITY: In Stock; CHECK_PRICES: https://www.snapeda.com/parts/UMH3NTN/Rohm/view-part/?ref=eda; DESCRIPTION: Pre-Biased Bipolar Transistor (BJT) 2 NPN - Pre-Biased (Dual) 50V 100mA 250MHz 150mW Surface Mount UMT6; MF: Rohm; MP: UMH3NTN; PACKAGE: SOT-363 Rohm; PRICE: None; PURCHASE-URL: https://www.snapeda.com/api/url_track_click_mouser/?unipart_id=355768&manufacturer=Rohm&part_name=UMH3NTN&search_term=umh3n; SNAPEDA_LINK: https://www.snapeda.com/parts/UMH3NTN/Rohm/view-part/?ref=snap
U14 = DFN8:STC8G1K08